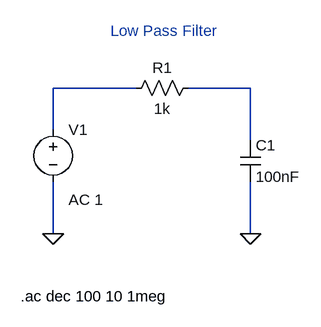
[diagram p0: schematic 4. LPF AC Analysis.asc]
4. LPF AC Analysis.asc, the LTspice schematic file:
Version 4
SHEET 1 880 680
WIRE 176 32 48 32
WIRE 352 32 256 32
WIRE 48 96 48 32
WIRE 352 112 352 32
WIRE 48 256 48 176
WIRE 352 256 352 176
FLAG 352 256 0
FLAG 48 256 0
SYMBOL voltage 48 80 R0
WINDOW 123 24 124 Left 2
WINDOW 39 0 0 Left 0
SYMATTR InstName V1
SYMATTR Value ""
SYMATTR Value2 AC 1
SYMBOL res 272 16 R90
WINDOW 0 0 56 VBottom 2
WINDOW 3 32 56 VTop 2
SYMATTR InstName R1
SYMATTR Value 1k
SYMBOL cap 336 112 R0
SYMATTR InstName C1
SYMATTR Value 100nF
TEXT -2 352 Left 2 !.ac dec 100 10 1meg
TEXT 136 -56 Left 2 ;Low Pass Filter

The netlist it stands for:
* 4. LPF AC Analysis.asc
V1 N001 0 AC 1
R1 N002 N001 1k
C1 N002 0 100nF
.ac dec 100 10 1meg
* Low Pass Filter
.backanno
.end